# EAGLE design openmv motor shield (EAGLE 9.6.2)
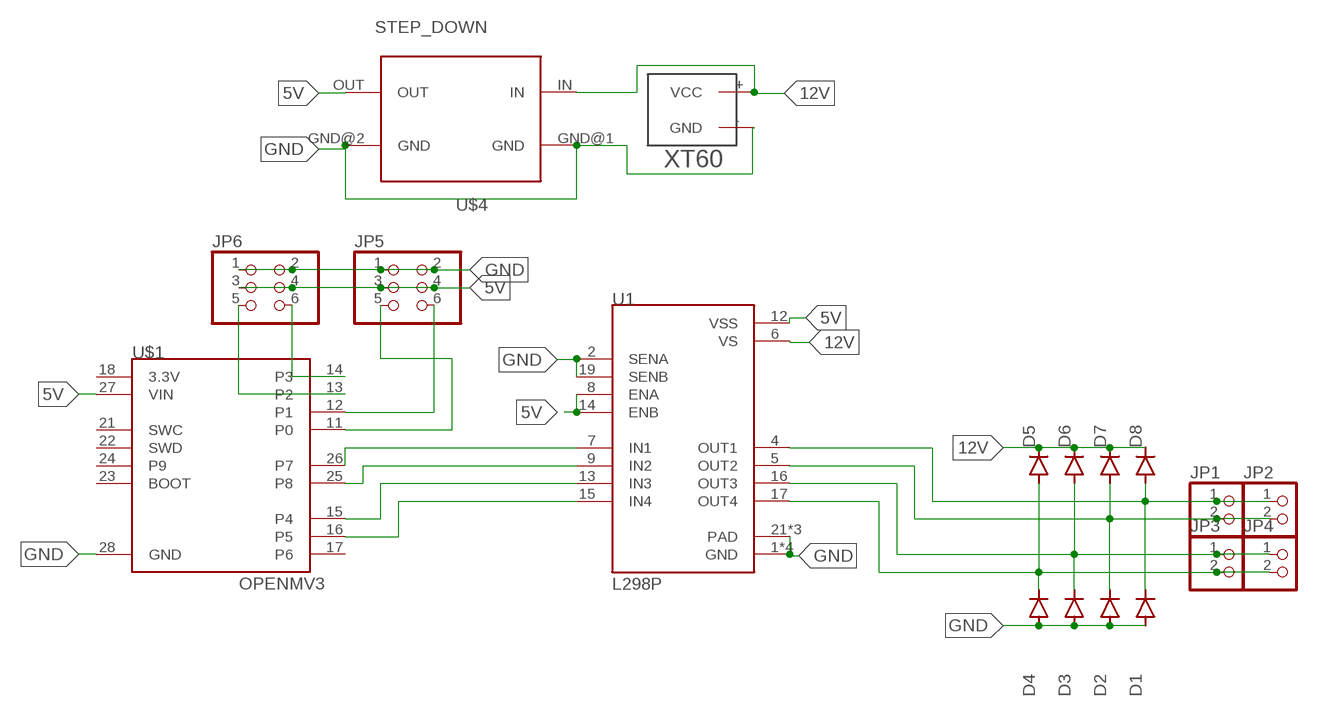
[diagram p0: schematic, sheet 1]

## Parts
D1  SRP100  [DO41-10]
D2  SRP100  [DO41-10]
D3  SRP100  [DO41-10]
D4  SRP100  [DO41-10]
D5  SRP100  [DO41-10]
D6  SRP100  [DO41-10]
D7  SRP100  [DO41-10]
D8  SRP100  [DO41-10]
JP1  PINHD-1X2  [1X02]
JP2  PINHD-1X2  [1X02]
JP3  PINHD-1X2  [1X02]
JP4  PINHD-1X2  [1X02]
JP5  PINHD-2X3  [2X03]
JP6  PINHD-2X3  [2X03]
U1  L298P  [SOIC127P1420X360-20N]
U$1  OPENMV3  [OPENMV3]
U$2  XT60  [XT60]
U$4  STEP_DOWN  [STEP_DOWN_5V]

## Nets
5V: JP5.3 JP5.4 JP6.3 JP6.4 U1.8(ENA) U1.12(VSS) U1.14(ENB) U$1.27(VIN) U$4.OUT
12V: D5.C D6.C D7.C D8.C U1.6(VS) U$2.+(VCC) U$4.IN
GND: D1.A D2.A D3.A D4.A JP5.1 JP5.2 JP6.1 JP6.2 U1.1(GND) U1.2(SENA) U1.10(GND) U1.11(GND) U1.19(SENB) U1.20(GND) U1.21(PAD) U1.22(PAD) U1.23(PAD) U$1.28(GND) U$2.-(GND) U$4.GND@1(GND) U$4.GND@2(GND)
N$1: D4.C D5.A JP3.2 JP4.2 U1.17(OUT4)
N$2: JP5.5 U$1.11(P0)
N$3: D3.C D6.A JP3.1 JP4.1 U1.16(OUT3)
N$4: D2.C D7.A JP1.2 JP2.2 U1.5(OUT2)
N$5: D1.C D8.A JP1.1 JP2.1 U1.4(OUT1)
N$6: U1.7(IN1) U$1.26(P7)
N$7: U1.9(IN2) U$1.25(P8)
N$8: U1.13(IN3) U$1.15(P4)
N$9: U1.15(IN4) U$1.16(P5)
N$10: JP5.6 U$1.12(P1)
N$11: JP6.5 U$1.13(P2)
N$12: JP6.6 U$1.14(P3)
Unconnected: U$1.17(P6) U$1.18(3.3V) U$1.21(SWC) U$1.22(SWD) U$1.23(BOOT) U$1.24(P9)

## Library data of the parts
D1-D8 = diode:SRP100: DIODE
JP1-JP4 = pinhead:PINHD-1X2: PIN HEADER
JP5 JP6 = pinhead:PINHD-2X3: PIN HEADER
U1 = !L298P:L298P: L298 Series Dual Full Bridge 4 A 46 V Driver Surface Mount - PowerSO-20 Check availability <https://pricing.snapeda.com/parts/L298P/STMicroelectronics/view-part?ref=eda>; AVAILABILITY: In Stock; DESCRIPTION: Half Bridge (4) Driver DC Motors, Relays, Solenoids, Stepper Motors Bipolar PowerSO-20; MF: STMicroelectronics; MP: L298P; PACKAGE: SO-20 STMicroelectronics; PRICE: None; PURCHASE-URL: https://pricing.snapeda.com/search/part/L298P/?ref=eda
U$1 = !OpenMV:OPENMV3
U$2 = ! xt60:XT60: XT60
U$4 = ! Custom Parts:STEP_DOWN

## Board
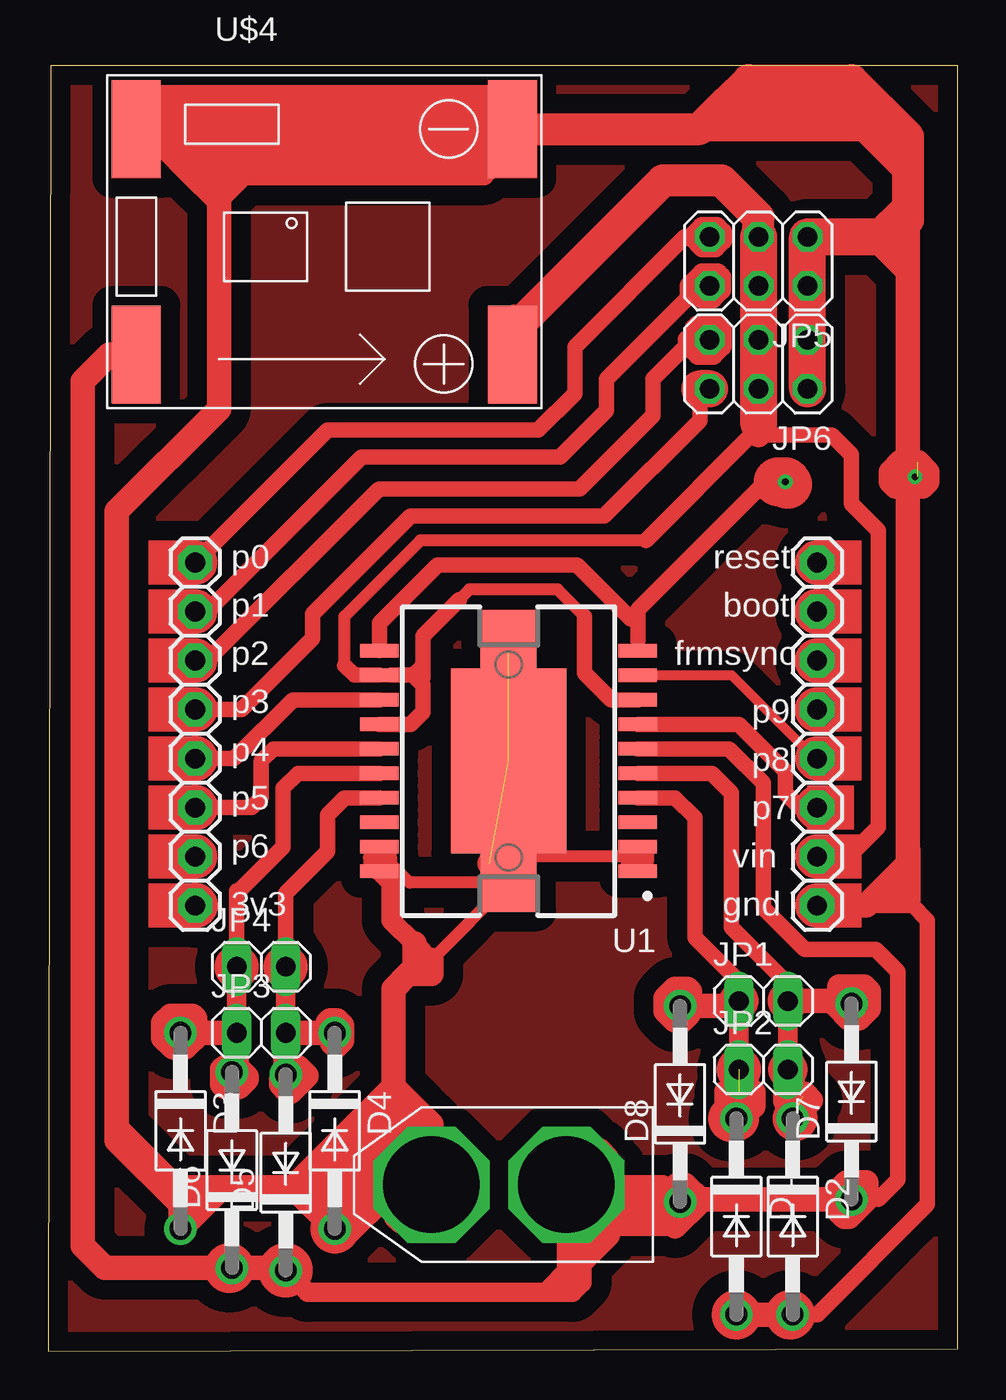
[diagram p1: board, top side]
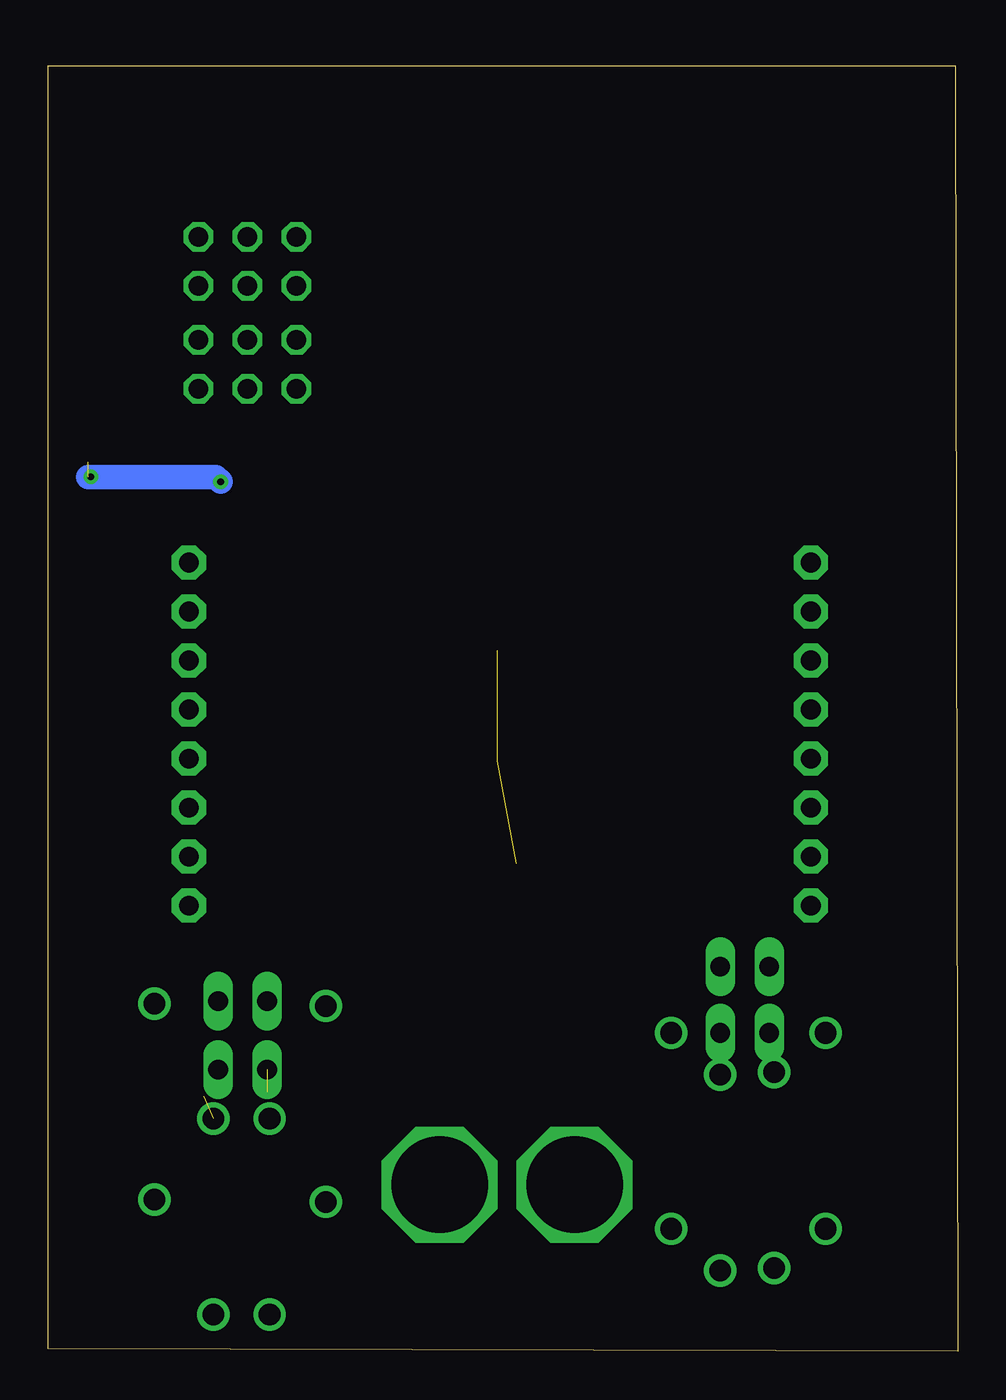
[diagram p2: board, bottom side, seen from below]

Size 47.17 x 66.67 mm. Coordinates in mm from the lower left corner, seen from the top.
Outline: 0,0 47.17,0.13 47.17,66.67 0.13,66.67 0,0
Copper layers (1*16): Top 0.035mm / dielectric 1.5mm / Bottom 0.035mm
Design rules "default": minimum track width 6mil, minimum drill 0.35mm, track to track 6mil, track to pad 6mil, pad to pad 6mil, via to via 6mil, smd to smd 6mil, copper to edge 40mil, drill to drill 6mil, minimum pad ring 10mil, minimum via ring 8mil, stop-mask expansion 4mil, vias tented up to drill 0mil, thermal gap 10mil

### Footprints (pad centres in the part's own frame; a part is rotated, then mirrored left to right if it is on the bottom)
DO41-10 = drill 1.118: A 5.08,0; C -5.08,0
1X02 = drill 1.016 long: 1 -1.27,0; 2 1.27,0
2X03 = drill 1.016 octagon: 1 -2.54,-1.27; 2 -2.54,1.27; 3 0,-1.27; 4 0,1.27; 5 2.54,-1.27; 6 2.54,1.27
SOIC127P1420X360-20N = smd 2 x 0.7: 1 -6.7,5.715; 2 -6.7,4.445; 3 -6.7,3.175; 4 -6.7,1.905; 5 -6.7,0.635; 6 -6.7,-0.635; 7 -6.7,-1.905; 8 -6.7,-3.175; 9 -6.7,-4.445; 10 -6.7,-5.715; 11 6.7,-5.715; 12 6.7,-4.445; 13 6.7,-3.175; 14 6.7,-1.905; 15 6.7,-0.635; 16 6.7,0.635; 17 6.7,1.905; 18 6.7,3.175; 19 6.7,4.445; 20 6.7,5.715 | smd 6 x 9.6: 21 0,0 | smd 2.9 x 3.05: 22 0,6.3; 23 0,-6.3
OPENMV3 = drill 1.016 pad 1.778 octagon: 11 1.651,19.304; 12 1.651,16.764; 13 1.651,14.224; 14 1.651,11.684; 15 1.651,9.144; 16 1.651,6.604; 17 1.651,4.064; 18 1.651,1.524; 21 33.909,19.304; 22 33.909,16.764; 23 33.909,14.224; 24 33.909,11.684; 25 33.909,9.144; 26 33.909,6.604; 27 33.909,4.064; 28 33.909,1.524
XT60 = drill 5 octagon: + 4.5,0; - 11.5,0
STEP_DOWN_5V = smd 2.54 x 5.08: GND@1 1.524,14.47; GND@2 21.018,14.47; IN 1.524,2.794; OUT 21.018,2.794

### Placement (x,y rotation side)
D1  35.69,6.99 270 top
D2  38.61,6.99 270 top
D3  6.86,11.43 270 top
D4  14.86,11.43 270 top
D5  12.32,9.27 90 top
D6  9.53,9.4 90 top
D7  41.66,12.95 90 top
D8  32.77,12.83 90 top
JP1  37.08,18.16 0 top
JP2  37.08,14.61 0 top
JP3  11.05,16.51 0 top
JP4  11.05,19.94 0 top
JP5  36.83,56.52 180 top
JP6  36.83,51.18 180 top
U1  23.88,30.61 180 top
U$1  5.97,21.59 0 top
U$2  31.37,8.64 180 top
U$4  3.05,48.9 0 top

### Tracks (layer width: path | path; a pad name or v marks a point on that pad's centre or on a via)
5V
  Top 0.508: 19.43,33.15 19.43,34.42 18.8,35.05 17.78,35.05 U1.12
  Top 0.61: 15.37,35.56 15.37,38.1 19.3,42.04 30.99,42.04 | 24.13,53.98 24.13,52.96 | 24.13,51.75 U$4.OUT | 21.34,38.99 21.84,39.5 26.42,39.5 27.81,38.1 | 19.43,35.56 19.43,37.08 | 19.43,34.54 19.43,34.92 19.43,35.56 | 18.8,35.05 19.3,35.56 19.43,35.56
  Top 0.813: U$1.27 41.53,25.65 43.05,27.18 43.05,42.55 41.66,43.94 41.66,46.48 40.64,47.5 36.83,47.5 36.45,47.5 30.99,42.04 | U1.8 29.21,33.78 27.81,35.18 27.81,38.1 | U1.14 18.8,32.51 19.43,33.15 19.43,34.54 18.92,35.05 17.78,35.05 | U1.12 15.88,35.05 15.37,35.56 | 19.43,34.92 19.43,37.08 21.34,38.99
  Top 1.27: 23.5,51.12 U$4.OUT | 36.83,58.8 JP5.3 JP5.4 JP6.3 JP6.4 36.83,48.13 36.83,47.5 | 24.13,52.96 24.13,51.75
  Top 1.651: 36.83,48.13 36.83,58.8 34.92,60.71 31.88,60.71 24.13,52.96
  Top 1.905: JP5.3 36.83,48.13
12V
  Top 0.61: 42.42,7.87 43.05,7.87
  Top 0.813: U1.6 35.31,31.24 37.08,29.46 37.08,22.99 39.24,20.83 42.93,20.83 44.07,19.68 44.07,8.89 43.05,7.87
  Top 1.016: U$2.+ 31.88,8.64 D8.C 32.26,7.24 29.08,7.24 28.57,7.75 28.57,8 31.75,8 31.88,7.87 | 12.19,4.32 13.46,3.05 27.18,3.05 27.69,3.56 27.69,4.7 27.69,7.82 U$2.+ | U$2.+ 29.03,6.48 32.51,6.48 | 26.87,6.6 26.87,4.14 26.04,3.3
  Top 1.27: 33.78,7.87 40.77,7.87 40.77,8.13 41.4,8.76 42.42,8.76 42.42,8.51 42.29,8.51 D7.C 41.02,7.24 41.28,6.99 41.53,6.99 42.42,7.87 | U$4.IN 3.18,51.69 1.78,50.29 1.78,5.46 2.92,4.32 D6.C 12.19,4.32 D5.C | D8.C 32,6.99 32.51,6.48 33.78,7.75 33.78,7.87 | 33.78,7.87 33.02,8.64 32.64,8.64 31.88,7.87 | 26.87,6.6 24.64,8.84 24.64,9.14 26.04,10.54 26.92,10.54 27.05,10.41 28.57,10.41 28.96,10.03 28.96,9.27 27.5,9.27 U$2.+ 25.91,7.67 25.91,6.48 25.65,6.48 24.51,7.62 24.51,7.87 26.29,9.65 26.92,9.65 26.92,7.49 | 27.69,4.7 29.03,6.04 29.03,6.48
EEE
  pour Top (isolate 1.016): 0.13,66.67 47.12,66.67 47.12,0.13 0,0.13 0,66.67
GND  (via drill 0.35)  (3 unrouted)
  Top 0.508: 30.58,25.62 U1.1 | 30.58,25.62 30.58,25.65 U1.2 29.97,25.56 29.97,25.02 30.58,25.62 | 17.18,26.04 U1.19 | 17.18,25.3 17.18,25.37 16.51,26.04
  Top 0.61: U1.20 17.18,25.3 17.46,25.59 | 17.46,25.59 17.78,25.91 17.65,26.04 17.18,26.04 | U1.1 31.11,25.43 31.11,25.91 | 16.64,25.15 16.64,25.62 U1.19 17.78,25.56 17.78,25.02 | 23.88,36.32 U1.23 | 30.23,37.97 30.58,37.62 30.58,36.83 U1.10 | 30.58,25.65 25.22,25.65 U1.22 | U1.22 19.87,20.3 | U1.22 18.75,24.31 17.46,25.59
  Top 0.813: 30.58,36.83 30.58,38.45 37.21,45.09 37.85,45.09 | 30.23,37.97 27.43,40.77 20.19,40.77 17.18,37.75 U1.11 | D2.A 39.88,1.91 45.59,7.62 45.59,22.35 44.83,23.11 | 44.83,23.11 43.56,23.11 | 43.56,23.11 42.42,23.11 | 44.83,23.11 44.58,23.37 44.58,24.89 | 44.58,24.89 44.58,26.29 44.83,26.04 44.83,23.11 | 43.56,23.11 44.07,23.62 44.07,24.38 44.58,24.89
  Top 1.016: U1.20 17.78,24.29 17.78,22.35 18.99,21.14 19.83,20.3 19.87,20.3 | 35.31,1.52 D1.A | U$4.GND@1 6.35,65.14 | 23.11,65.14 6.35,65.14 | 6.35,65.14 4.7,65.14 | 23.75,61.59 7.62,61.59 7.27,61.24 7.55,60.96 10.16,60.96 | 10.16,60.96 22.61,60.96 23.31,61.67 23.31,62.61 | 8.86,59.66 10.16,60.96
  Top 1.27: D1.A D2.A | 19.87,20.3 19.87,19.56 18.67,19.56 | U1.22 22.88,25.3 | U$1.28 42.42,23.11 44.58,25.27 44.58,26.29 44.58,46.1 | 44.58,46.1 44.58,56.01 | 44.58,56.01 44.58,57.66 | 44.58,57.66 44.58,58.67 44.58,59.44 | 44.58,59.44 44.58,61.09 42.3,63.37 35.56,63.37 U$4.GND@2 | 45.09,46.1 45.59,45.59 45.59,45.09 45.34,44.83 43.94,44.83 43.69,45.09 43.69,45.59 44.2,46.1 44.58,46.1 | U$4.GND@1 5.34,64.14 24,64.14 24.07,64.07 U$4.GND@2 | U$4.GND@2 23.31,62.61 4.95,62.61 4.57,62.99 U$4.GND@1 | U$4.GND@1 21.84,63.37 21.97,63.5 22.86,63.5 | D4.A 12.83,8.38 | 12.83,8.38 8.89,8.38 D3.A 6.86,7.62 3.56,10.92 3.56,11.56 | 12.83,8.38 12.83,8.64 16.38,12.19 | 17.91,13.72 17.91,18.8 18.67,19.56 | 16.38,12.19 17.91,13.72 | 18.67,19.56 18.99,19.88 18.99,21.14 | U$4.GND@1 6.19,63.37 6.19,62.32 7.27,61.24 8.86,59.66 8.86,48.86 3.56,43.56 3.56,11.56 | JP6.2 JP6.1 JP5.2 JP5.1 42.8,57.78 | 42.8,57.78 43.43,57.78 44.45,57.78 44.58,57.66 | 42.8,57.78 44.58,56.01 | 42.8,57.78 44.45,59.44 44.58,59.44 | U$2.- 19.87,11.75 19.18,12.45 | 19.18,12.45 17.91,13.72 | U$2.- 16.38,12.12 16.38,12.19 | 12.83,8.38 14.1,8.38 18.16,12.45 19.18,12.45 | D4.A 14.86,8.13 19.18,12.45 | D4.A 14.86,6.6 19.18,10.92 | 12.83,8.38 12.7,8.51 6.6,8.51 3.56,11.56 | U$2.- 18.6,7.37 18.03,7.37 18.03,6.99 18.29,6.73 20.96,6.73 21.97,7.75 21.97,9.4 20.57,10.79 20.07,10.29 20.07,9.91 21.08,8.89 21.08,8.13 20.32,7.37 19.94,7.37
  Top 1.651: U$4.GND@2 33.77,63.37 35.23,64.82 | 44.58,62.36 42.11,64.82 35.23,64.82 | 44.58,62.36 44.58,58.67 | 35.23,64.82 36.32,65.91 41.66,65.91 44.58,62.99 44.58,62.36
  Top 1.905: JP6.2 JP5.1 43.43,57.78
  Top 2.54: 37.85,45.09 v38.23,45.09 38.35,44.96 | D4.A 17.14,8.64 U$2.-
  Bottom 1.27: v38.23,45.09 38.48,45.34 v44.96,45.34 45.09,45.34
N$1
  Top 0.813: U1.17 15.37,28.7 14.48,27.81 14.48,25.91 12.32,23.75 JP4.2
  Top 1.016: JP4.2 JP3.2
  Top 1.27: D5.A JP3.2 D4.C | D5.A 12.57,14.35 12.95,14.73 13.4,14.29 12.57,13.46 12.45,13.46 12.07,13.84 12.07,14.1 D5.A | D4.C 14.48,16.89 14.48,17.02 14.61,17.14 14.99,17.14 15.24,16.89 15.24,16.13 14.92,15.81 14.73,16 14.86,16.13 D4.C
N$2
  Top 0.813: U$1.11 14.48,47.75 25.4,47.75 27.31,49.66 27.31,52.07 33.02,57.78 33.38,57.78 JP5.5
  Top 1.016: 33.38,57.78 33.93,57.23 34.59,57.23 34.95,57.58 34.95,58.04 34.67,58.32 33.91,58.32 33.38,57.78
N$3
  Top 0.813: U1.16 12.95,29.97 12.19,29.21 12.19,26.16 9.91,23.88 9.78,23.88 JP4.1
  Top 1.016: JP4.1 JP3.1
  Top 1.27: D3.C 7.49,17.14 7.62,17.14 7.62,17.27 7.49,17.4 6.35,17.4 5.97,17.02 5.97,16.26 6.48,15.75 7.11,15.75 7.87,16.51 JP3.1 9.78,14.73 9.14,14.73 9.02,14.61 9.02,13.84 9.14,13.72 9.91,13.72 10.29,14.1 10.29,14.22 10.03,14.48 D6.A
N$4  (1 unrouted)
  Top 0.813: U1.5 34.42,29.97 35.43,28.96 35.43,21.97 38.35,19.05 JP1.2
  Top 1.016: JP1.2 JP2.2
  Top 1.27: JP1.2 40.89,18.16 40.89,17.91 41.53,17.27 42.04,17.27 42.55,17.78 42.55,18.67 42.29,18.92 41.02,18.92 41.02,18.67 D7.A | JP2.2 38.61,14.35 D2.C | 39.12,13.21 39.24,13.34 39.56,13.02 39.12,12.57 38.61,12.57 38.23,12.95 38.23,13.34 38.61,13.34
N$5  (1 unrouted)
  Top 0.61: JP1.1 35.81,19.18
  Top 0.813: U1.4 32.51,28.7 33.53,27.69 33.53,21.46 35.81,19.18
  Top 1.016: JP1.1 JP2.1
  Top 1.27: JP1.1 35.56,17.91 D8.A 33.21,17.46 32.89,17.14 32.51,17.14 32,17.65 32,18.29 32.51,18.8 33.15,18.8 33.27,18.67 | JP2.1 35.81,12.19 D1.C | 36.07,13.46 36.58,13.46 36.58,12.7 35.43,12.7 35.18,12.95 35.18,13.46 35.81,13.46
N$6
  Top 0.813: U1.7 35.81,32.51 38.23,30.1 38.23,28.96 38.99,28.19 U$1.26
N$7
  Top 0.508: U1.9 35.43,35.05 39.75,30.73 U$1.25
N$8
  Top 0.813: U$1.15 9.65,30.73 12.7,33.78 U1.13
N$9
  Top 0.813: U1.15 11.68,31.24 11.05,30.61 11.05,28.7 10.54,28.19 U$1.16
N$10
  Top 0.813: U$1.12 8.25,38.35 16.26,46.35 26.54,46.35 28.96,48.77 28.96,50.42 33.25,54.71
  Top 1.016: JP5.6 33.76,54.71 33.88,54.59 34.47,54.59 34.9,55.02 34.9,55.73 34.72,55.91 33.91,55.91 33.25,55.24 33.25,54.71
N$11
  Top 0.813: U$1.13 8.25,35.81 17.14,44.7 27.56,44.7 31.37,48.51 31.37,50.42 33.4,52.45 JP6.5
  Top 1.016: JP6.5 33.83,52.91 33.5,52.91 33.5,53.06 33.66,53.21 34.77,53.21 34.92,53.06 34.92,52.09 34.49,51.66 33.68,51.66 33.46,51.88 33.46,52.13 33.15,52.45
N$12
  Top 0.813: U$1.14 10.03,33.27 13.72,36.96 13.72,38.23 18.8,43.31 28.83,43.31 33.78,48.26 33.78,49.91
  Top 1.905: JP6.6 33.78,49.91
(copper drawn outside any net)
  shapes: Top area x16, Top circle x30